# Altium schematic sheet Microcontroller.SchDoc
size A3; SheetNumber: 4; SheetTotal: 5
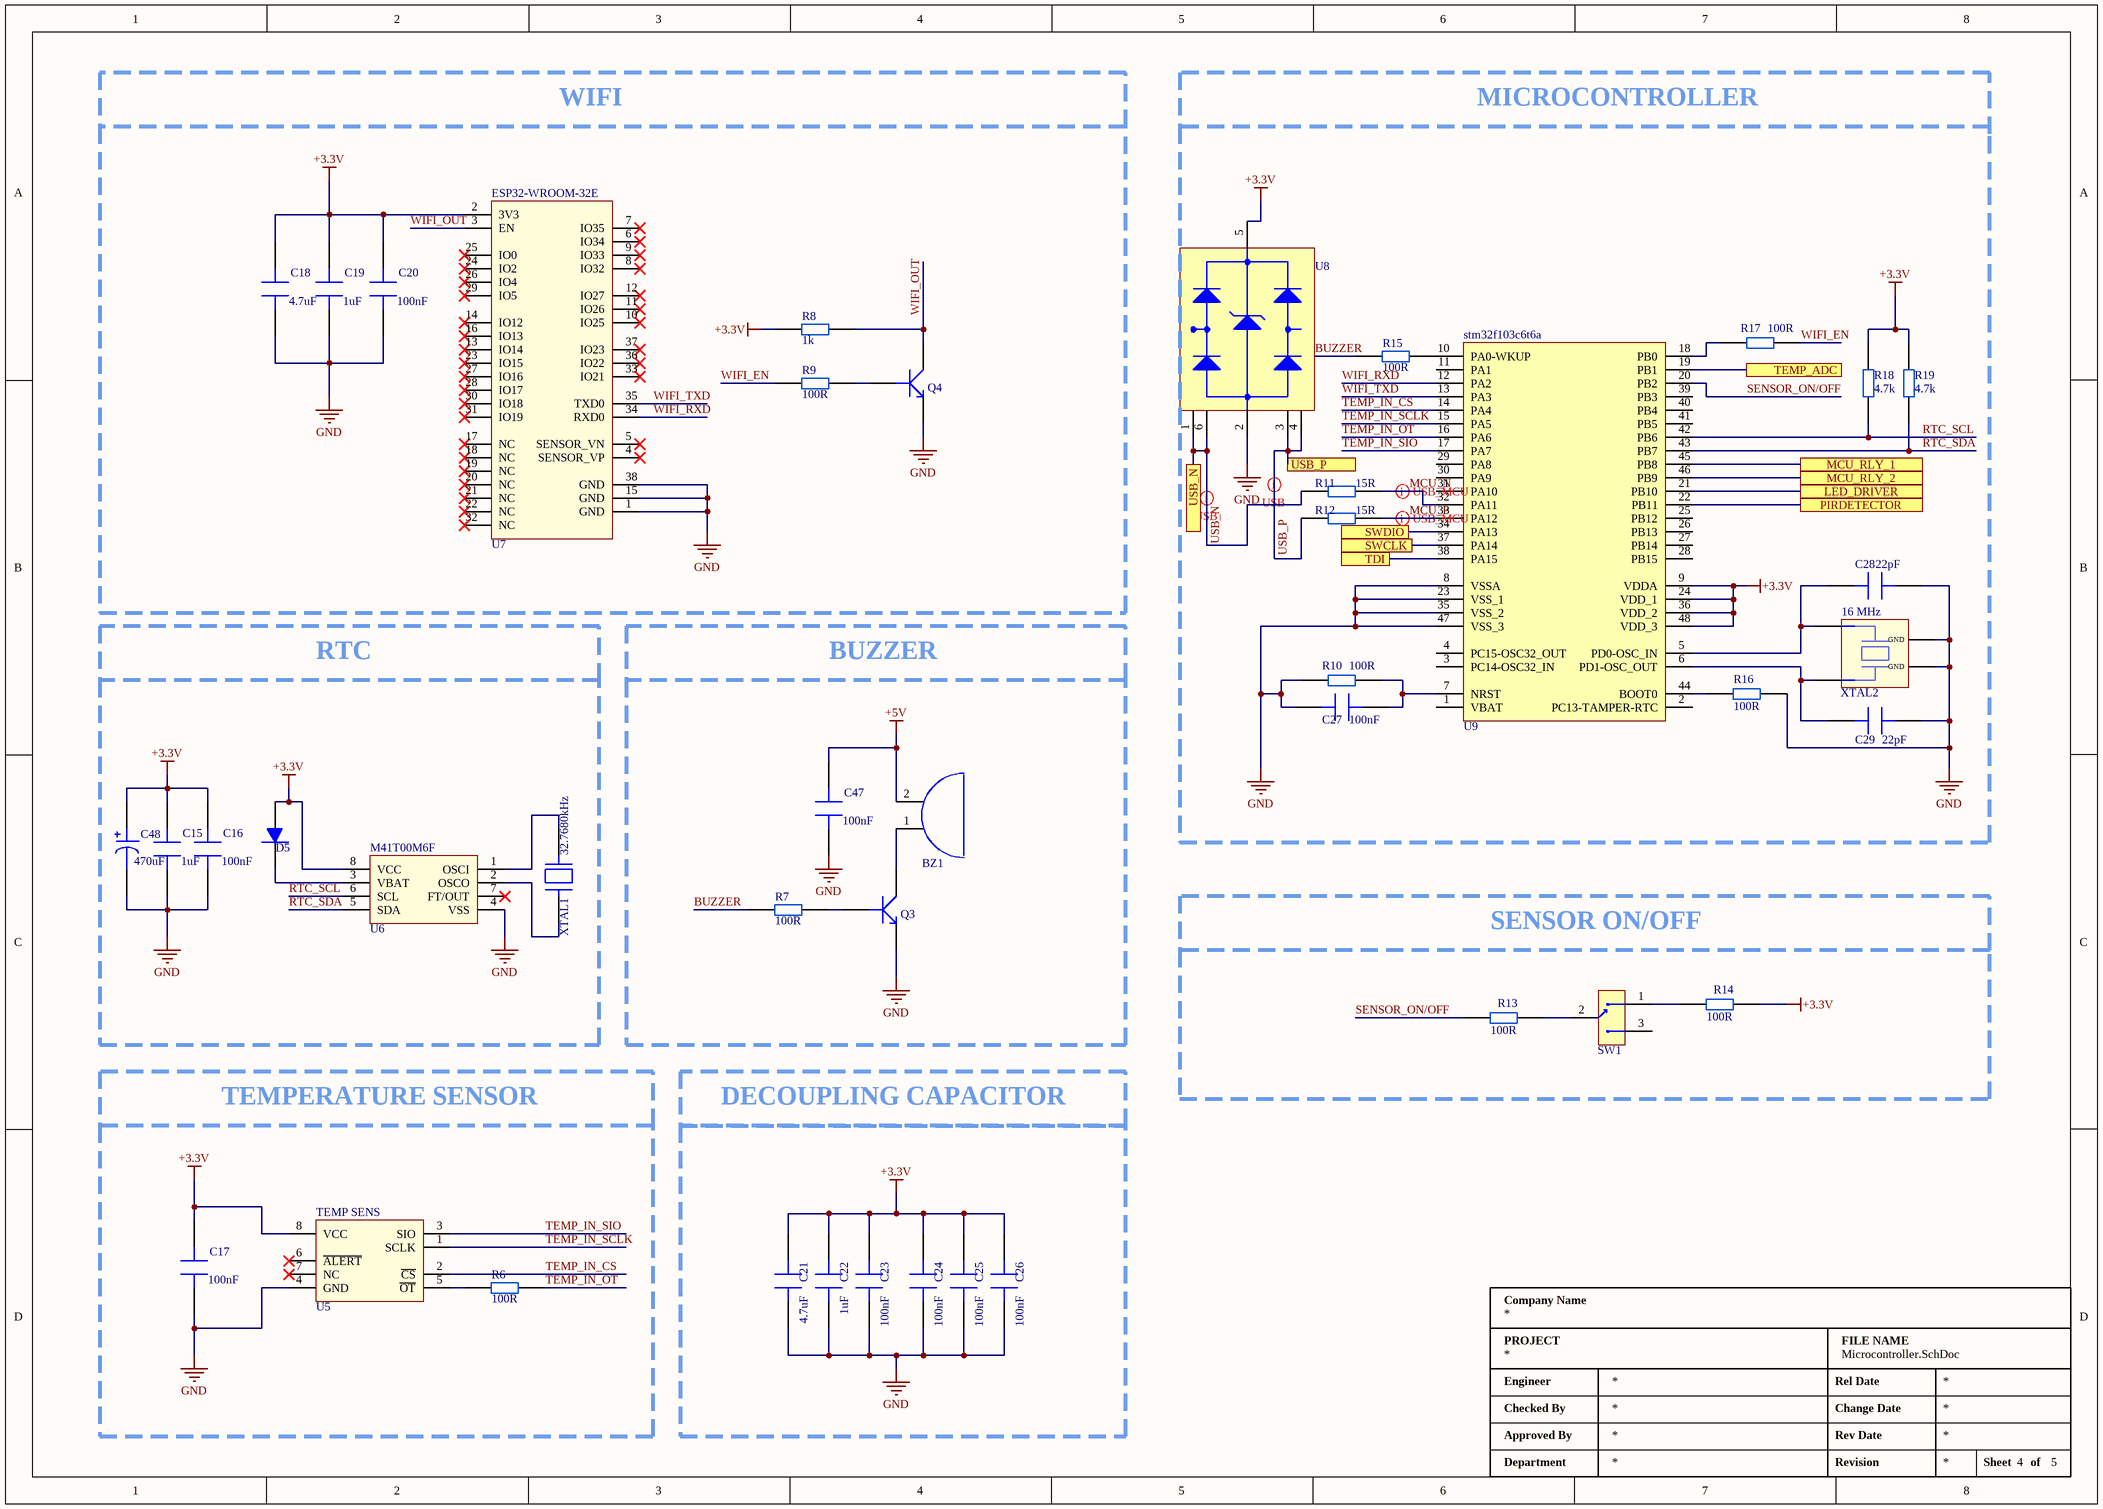
[diagram p0: Microcontroller.SchDoc]

## Parts
BZ1  CMI-9605-0580T  [BUZZER]  (value not drawn)
C15  value 1uF  [CAP 0805]  (hidden comment: Auto Grade Capacitor,0805,X7R,10)
C16  value 100nF  [CAP 0805]  (hidden comment: CAP CER 0.1UF 50V X7R 0805)
C17  value 100nF  [CAP 0603]  (hidden comment: CAP CER 100nF 0603)
C18  value 4.7uF  [CAP 0805]  (hidden comment: CAP CER 4.7UF 25V X5R 0805)
C19  value 1uF  [CAP 0805]  (hidden comment: Auto Grade Capacitor,0805,X7R,10)
C20  value 100nF  [CAP 0805]  (hidden comment: CAP CER 0.1UF 50V X7R 0805)
C21  value 4.7uF  [CAP 0805]  (hidden comment: CAP CER 4.7UF 25V X5R 0805)
C22  value 1uF  [CAP 0805]  (hidden comment: Auto Grade Capacitor,0805,X7R,10)
C23  value 100nF  [CAP 0805]  (hidden comment: CAP CER 0.1UF 50V X7R 0805)
C24  value 100nF  [CAP 0805]  (hidden comment: CAP CER 0.1UF 50V X7R 0805)
C25  value 100nF  [CAP 0805]  (hidden comment: CAP CER 0.1UF 50V X7R 0805)
C26  value 100nF  [CAP 0805]  (hidden comment: CAP CER 0.1UF 50V X7R 0805)
C27  value 100nF  [CAP 0805]  (hidden comment: CAP CER 0.1UF 50V X7R 0805)
C28  value 22pF  [CAP 0603]  (hidden comment: CAP CER 22PF 50V C0G/NP0 0603)
C29  value 22pF  [CAP 0603]  (hidden comment: CAP CER 22PF 50V C0G/NP0 0603)
C47  value 100nF  [CAP 0805]  (hidden comment: CAP CER 0.1UF 50V X7R 0805)
C48  value 470uF  [CAP ALUM 470UF 20% 50V RADIAL TH]  (hidden comment: CAP ALUM 470UF 20% 50V RADIAL TH)
D5  DIODE GEN PURP 75V 150MA SOD323F  [DIODE SOD323F]  (value not drawn)
Q3  TRANS NPN 40V 0.2A SOT23  [SOT-23-3]  (value not drawn)
Q4  TRANS NPN 40V 0.2A SOT23  [SOT-23-3]  (value not drawn)
R6  value 100R  [RES 0603]  (hidden comment: RES 10K 0603)
R7  value 100R  [RES 0603]  (hidden comment: RES 10K 0603)
R8  value 1k  [RES 0603]  (hidden comment: RES 10K 0603)
R9  value 100R  [RES 0603]  (hidden comment: RES 10K 0603)
R10  value 100R  [RES 0603]  (hidden comment: RES 10K 0603)
R11  value 15R  [RES 0603]  (hidden comment: RES 15 OHM 1% 1/10W 0603)
R12  value 15R  [RES 0603]  (hidden comment: RES 15 OHM 1% 1/10W 0603)
R13  value 100R  [RES 0603]  (hidden comment: RC0603JR-070RL)
R14  value 100R  [RES 0603]  (hidden comment: RC0603JR-070RL)
R15  value 100R  [RES 0603]  (hidden comment: RES 10K 0603)
R16  value 100R  [RES 0603]  (hidden comment: RES 10K 0603)
R17  value 100R  [RES 0603]  (hidden comment: RES 10K 0603)
R18  value 4.7k  [RES 0603]  (hidden comment: RES 10K 0603)
R19  value 4.7k  [RES 0603]  (hidden comment: RES 10K 0603)
SW1  EG1215AA  [EG1215AA]  (value not drawn)
U5  TEMP SENS  [SOIC8]
U6  M41T00M6F  [SOIC8]
U7  ESP32-WROOM-32E  [ESP32 WROOM 4MB]
U8  TVS DIODE 5.25VWM 17VC SOT23-6  [SOT23-6]  (value not drawn)
U9  stm32f103c6t6a  [LQFP-48]
XTAL1  32.7680kHz  [CRYSTALL 2SMD]
XTAL2  16 MHz  [CRYSTAL 16MHz 4SMD]

## Blocks framed on the sheet
WIFI: C18-C20 Q4 R8 R9 U7
MICROCONTROLLER: C27-C29 R10-R12 R15-R19 U8 U9 XTAL2
RTC: C15 C16 C48 D5 U6 XTAL1
BUZZER: BZ1 C47 Q3 R7
SENSOR ON/OFF: R13 R14 SW1
TEMPERATURE SENSOR: C17 R6 U5
DECOUPLING CAPACITOR: C21-C26

## Ports
LED_DRIVER (see Power Management[6C], SensorBoard[4D], SensorBoard[6B]), MCU_RLY_1 (see Power Management[4B]), MCU_RLY_2 (see Power Management[6B]), PIRDETECTOR (see Power Management[6C]), SWCLK (see Power Management[4C]), SWDIO (see Power Management[4C]), TDI (see Power Management[4D]), TEMP_ADC (see Power Management[6C], SensorBoard[3D], SensorBoard[6A]), USB_N (see Power Management[6C]), USB_P (see Power Management[6C])

## Nets
+3.3V: C15.2 C16.2 C17.2 C18.2 C19.2 C20.2 C21.2 C22.2 C23.2 C24.2 C25.2 C26.2 C48.1 D5.A R8.2 R14.2 R18.2 R19.2 U5.8(VCC) U6.8(VCC) U7.2(3V3) U8.5(VBUS) U9.9(VDDA) U9.24(VDD_1) U9.36(VDD_2) U9.48(VDD_3)
+5V: BZ1.2 C47.2
GND: C15.1 C16.1 C17.1 C18.1 C19.1 C20.1 C21.1 C22.1 C23.1 C24.1 C25.1 C26.1 C27.1 C28.1 C29.1 C47.1 C48.2 Q3.2(E) Q4.2(E) R10.2 R16.1 U5.4(GND) U6.4(VSS) U7.1(GND) U7.15(GND) U7.38(GND) U8.2(GND) U9.8(VSSA) U9.23(VSS_1) U9.35(VSS_2) U9.47(VSS_3) XTAL2.2(GND) XTAL2.4(GND)
BUZZER: R7.1 R15.1
LED_DRIVER: U9.21(PB10) ; port LED_DRIVER
MCU_N: R11.2 U9.32(PA11)
MCU_P: R12.2 U9.33(PA12)
MCU_RLY_1: U9.45(PB8) ; port MCU_RLY_1
MCU_RLY_2: U9.46(PB9) ; port MCU_RLY_2
PIRDETECTOR: U9.22(PB11) ; port PIRDETECTOR
RTC_SCL: R18.1 U6.6(SCL) U9.42(PB6)
RTC_SDA: R19.1 U6.5(SDA) U9.43(PB7)
SENSOR_ON/OFF: R13.1 U9.20(PB2)
SWCLK: U9.37(PA14) ; port SWCLK
SWDIO: U9.34(PA13) ; port SWDIO
TDI: U9.38(PA15) ; port TDI
TEMP_ADC: U9.19(PB1) ; port TEMP_ADC
TEMP_IN_CS: U5.2(~{CS}) U9.14(PA4)
TEMP_IN_OT: R6.2 U9.16(PA6)
TEMP_IN_SCLK: U5.1(SCLK) U9.15(PA5)
TEMP_IN_SIO: U5.3(SIO) U9.17(PA7)
USB_N: R11.1 U8.1(I/O1_IN) U8.6(I/O1_OUT) ; port USB_N
USB_P: R12.1 U8.3(I/O2_IN) U8.4(I/O2_OUT) ; port USB_P
WIFI_EN: R9.1 R17.1
WIFI_OUT: Q4.3(C) R8.1 U7.3(EN)
WIFI_RXD: U7.34(RXD0) U9.12(PA2)
WIFI_TXD: U7.35(TXD0) U9.13(PA3)
NetBZ1_1: BZ1.1 Q3.3(C)
NetC27_2: C27.2 R10.1 U9.7(NRST)
NetC28_2: C28.2 U9.5(PD0-OSC_IN) XTAL2.1(IN/OUT)
NetC29_2: C29.2 U9.6(PD1-OSC_OUT) XTAL2.3(OUT/IN)
NetD5_C: D5.C U6.3(VBAT)
NetQ3_1: Q3.1(B) R7.2
NetQ4_1: Q4.1(B) R9.2
NetR6_1: R6.1 U5.5(~{OT})
NetR13_2: R13.2 SW1.2
NetR14_1: R14.1 SW1.1
NetR15_2: R15.2 U9.10(PA0-WKUP)
NetR16_2: R16.2 U9.44(BOOT0)
NetR17_2: R17.2 U9.18(PB0)
NetU6_1: U6.1(OSCI) XTAL1.1
NetU6_2: U6.2(OSCO) XTAL1.2

Not connected (* = marked no-connect by the designer): SW1 3(_3); U5 6(~{ALERT})* 7(NC)*; U6 7(FT/OUT)*; U7 4(SENSOR_VP)* 5(SENSOR_VN)* 6(IO34)* 7(IO35)* 8(IO32)* 9(IO33)* 10(IO25)* 11(IO26)* 12(IO27)* 13(IO14)* 14(IO12)* 16(IO13)* 17(NC)* 18(NC)* 19(NC)* 20(NC)* 21(NC)* 22(NC)* 23(IO15)* 24(IO2)* 25(IO0)* 26(IO4)* 27(IO16)* 28(IO17)* 29(IO5)* 30(IO18)* 31(IO19)* 32(NC)* 33(IO21)* 36(IO22)* 37(IO23)*; U9 1(VBAT) 2(PC13-TAMPER-RTC) 3(PC14-OSC32_IN) 4(PC15-OSC32_OUT) 11(PA1) 25(PB12) 26(PB13) 27(PB14) 28(PB15) 29(PA8) 30(PA9) 31(PA10) 39(PB3) 40(PB4) 41(PB5)

## Layout directives
differential pair: MCU_N, MCU_P, USB_N, USB_P

## Notes on the sheet
- Company Name
- Engineer
- PROJECT
- Rel Date
- FILE NAME
- Checked By
- Approved By
- Rev Date
- Change Date
- Department
- Revision
- Sheet
- of

## Library data of the parts
BZ1 = CMI-9605-0580T: 9.6 mm, 5 Vdc, 80 dB, Through Hole, Driving Circuit, Magnetic Audio Indicator Buzzer; Manufacturer: CUI; Designed By: SEFA; Supplier: Digikey; Supplier Part Number: 102-CMI-9605-0580T-ND; Manufacturer Part Number: CMI-9605-0580T; RoHS: No
C15 C19 C22 = CAP MLCC 1uF 0805 MLCC: Multilayer Ceramic Capacitor, 1 uF, 25 V, ï¿½ 10%, X7R, 0805 [2012 Metric]; Manufacturer: KEMET; Manufacturer Part Number: C0805C105K3RACTU; Material: 4241ConductorMaterial; Voltage Rating: 25V; Supplier: Digikey; Supplier Part Number: 399-C0805C105K3RAC7800CT-ND; RoHS: Yes; Category: Ceramic Capacitors; Stock: 115775; Pricing: 1=0,13, 10=0,091, 50=0,054, 100=0,0425, 500=0,03142, 1000=0,02601 (USD); Mounting Technology: Surface Mount; Case/Package: 0805; Pins: 2; Case Code (Imperial): 0805; Case Code (Metric): 2012; Dielectric Material: Ceramic; Min Operating Temperature: -55°C; Max Operating Temperature: 125°C; Tolerance: 10%; Packaging: Tape and Reel; Termination: SMD/SMT; Series: C; Dielectric: X7R; Package Quantity: 2500; Voltage Rating (DC): 25V; Construction: Flat; Voltage: 25V; Length: 2mm; Width: 0.049inch; Height: 1.25mm; Depth: 1.25mm; Thickness: 0.055inch; Radiation Hardening: No; RoHS Compliant: Yes; Reach SVHC Compliant: No
C16 C20 C23-C27 C47 = CAP MLCC 100nF 0805: Multilayer Ceramic Capacitor, 0.1 uF, 50 V, ± 10%, X7R, 0805 [2012 Metric]; Manufacturer: Yageo; Manufacturer Part Number: CC0805KRX7R9BB104; Insulation Resistance: 100GR; Desined By: SEFA; Supplier: Digikey; Supplier Part Number: 311-1140-1-ND; RoHS: Yes; Category: Ceramic Capacitors; Stock: 4906465; Pricing: 1=0,1, 10=0,07, 50=0,0418, 100=0,0329, 500=0,02428, 1000=0,0201, 4000=0,01711, 8000=0,01592, 12000=0,01512, 28000=0,01433, 100000=0,01085, 200000=0,01059, 400000=0,00995 (USD); Mounting Technology: Surface Mount; Case/Package: 0805; Pins: 2; Case Code (Metric): 2012; Case Code (Imperial): 0805; Material: Ceramic; Min Operating Temperature: -55°C; Max Operating Temperature: 125°C; Tolerance: 10%; Dielectric: X7R; Voltage: 50V; Packaging: Tape and Reel; Voltage Rating: 50V; Package Quantity: 4000; Termination: SMD/SMT; Series: CC; Length: 2mm; Height: 0.85mm; Depth: 1.25mm; Radiation Hardening: No; RoHS Compliant: Yes; Reach SVHC Compliant: No; Lead Free: 5697LeadFree; Halogen Free: 5694HalogenFree; ComponentLink1URL: https://datasheet.ciiva.com/11786/0900766b80d84f1d-11786009.pdf?src-supplier=Rs; ComponentLink1Description: https://datasheet.ciiva.com/11786/0900766b80d84f1d-11786009.pdf?src-supplier=Rs; ComponentLink2URL: https://datasheet.ciiva.com/46393/1734573-46393307.pdf?src-supplier=Element14; ComponentLink2Description: https://datasheet.ciiva.com/46393/1734573-46393307.pdf?src-supplier=Element14; ComponentLink3URL: https://datasheet.ciiva.com/155/mlccorderingcode-155930.pdf?src-supplier=Digikey; ComponentLink3Description: https://datasheet.ciiva.com/155/mlccorderingcode-155930.pdf?src-supplier=Digikey; ComponentLink4URL: https://datasheet.ciiva.com/28450/1489800-28450805.pdf?src-supplier=Element14; ComponentLink4Description: https://datasheet.ciiva.com/28450/1489800-28450805.pdf?src-supplier=Element14; ComponentLink5URL: https://datasheet.ciiva.com/155/mlccorderingcode-155929.pdf?src-supplier=Digikey; ComponentLink5Description: https://datasheet.ciiva.com/155/mlccorderingcode-155929.pdf?src-supplier=Digikey; ComponentLink6URL: https://datasheet.ciiva.com/155/mlccorderingcode-155931.pdf?src-supplier=Digikey; ComponentLink6Description: https://datasheet.ciiva.com/155/mlccorderingcode-155931.pdf?src-supplier=Digikey; ComponentLink7URL: https://datasheet.ciiva.com/11464/upy-gphc-x7r-6-3v-to-50v-8-11464757.pdf?src-supplier=Avnet; ComponentLink7Description: https://datasheet.ciiva.com/11464/upy-gphc-x7r-6-3v-to-50v-8-11464757.pdf?src-supplier=Avnet; ComponentLink8URL: https://datasheet.ciiva.com/29242/445210-da-01-en-kerko-chip-0805-x7r-0-1uf-10proz-50vg-29242074.pdf?src-supplier=Conrad; ComponentLink8Description: https://datasheet.ciiva.com/29242/445210-da-01-en-kerko-chip-0805-x7r-0-1uf-10proz-50vg-29242074.pdf?src-supplier=Conrad
C17 = CAP MLCC 100nF 0603: Multilayer Ceramic Capacitor, 0.1 uF, 50 V, ± 10%, X7R, 0603 [1608 Metric]; Manufacturer: Kyocera AVX; Manufacturer Part Number: 06035C104K4T2A; Material: 4241ConductorMaterial; Voltage Rating: 50V; Dissipation Factor: 2.5%; Designed By: SEFA; Supplier: Mouser; Supplier Part Number: 581-06035C104K4; RoHS: Yes; Category: Ceramic Capacitors; Stock: 306954; Pricing: 1=0,1, 10=0,043, 50=0,043, 100=0,021, 1000=0,013, 10000=0,01 (USD); Mounting Technology: Surface Mount; Case/Package: 0603; Pins: 2; Case Code (Metric): 1608; Case Code (Imperial): 0603; Dielectric Material: 4241ConductorMaterial; Min Operating Temperature: -55°C; Max Operating Temperature: 125°C; Package Quantity: 1; Tolerance: 10%; Packaging: Tape and Reel; Voltage Rating (DC): 50V; Dielectric: X7R; Termination: SMD/SMT; Voltage: 50V; Series: -; Construction: Flat; Length: 1.6mm; Width: 0.032inch; Height: 0.9mm; Thickness: 0.035inch; Depth: 0.81mm; Ratings: AEC-Q200; Radiation Hardening: No; Lead Free: 5697LeadFree; Reach SVHC Compliant: No; RoHS Compliant: Yes; ComponentLink1URL: https://datasheet.ciiva.com/26859/getdatasheetpartid-379206-26859871.pdf?src-supplier=Verical; ComponentLink1Description: https://datasheet.ciiva.com/26859/getdatasheetpartid-379206-26859871.pdf?src-supplier=Verical; ComponentLink2URL: https://datasheet.ciiva.com/11786/0900766b80dc2409-11786365.pdf?src-supplier=Rs; ComponentLink2Description: https://datasheet.ciiva.com/11786/0900766b80dc2409-11786365.pdf?src-supplier=Rs; ComponentLink3URL: https://datasheet.ciiva.com/11503/cauto-11503989.pdf?src-supplier=Avnet; ComponentLink3Description: https://datasheet.ciiva.com/11503/cauto-11503989.pdf?src-supplier=Avnet; ComponentLink4URL: https://datasheet.ciiva.com/1457/1679506-1457867.pdf?src-supplier=Element14; ComponentLink4Description: https://datasheet.ciiva.com/1457/1679506-1457867.pdf?src-supplier=Element14; ComponentLink5URL: https://datasheet.ciiva.com/1124/1679506-1124898.pdf?src-supplier=Element14; ComponentLink5Description: https://datasheet.ciiva.com/1124/1679506-1124898.pdf?src-supplier=Element14; ComponentLink6URL: https://datasheet.ciiva.com/28613/1679506-28613279.pdf?src-supplier=Element14; ComponentLink6Description: https://datasheet.ciiva.com/28613/1679506-28613279.pdf?src-supplier=Element14; ComponentLink7URL: https://datasheet.ciiva.com/152/cauto-152703.pdf?src-supplier=Digikey; ComponentLink7Description: https://datasheet.ciiva.com/152/cauto-152703.pdf?src-supplier=Digikey; ComponentLink8URL: https://datasheet.ciiva.com/152/cauto-152702.pdf?src-supplier=Digikey; ComponentLink8Description: https://datasheet.ciiva.com/152/cauto-152702.pdf?src-supplier=Digikey; ComponentLink9URL: https://datasheet.ciiva.com/152/cauto-152704.pdf?src-supplier=Digikey; ComponentLink9Description: https://datasheet.ciiva.com/152/cauto-152704.pdf?src-supplier=Digikey; ComponentLink10URL: https://datasheet.ciiva.com/5427/cauto-360-5427029.pdf?src-supplier=Mouser; ComponentLink10Description: https://datasheet.ciiva.com/5427/cauto-360-5427029.pdf?src-supplier=Mouser
C18 C21 = CAP MLCC 4.7uF 0805 MLCC: Multilayer Ceramic Capacitor, 4.7 uF, 25 V, ± 10%, X5R, 0805 [2012 Metric]; Manufacturer: Samsung; Manufacturer Part Number: CL21A475KAQNNNE; Designed By: SEFA; Supplier: Digikey; Supplier Part Number: 1276-1244-2-ND; RoHS: Yes; Category: Ceramic Capacitors; Stock: 3176000; Pricing: 2000=0,01305, 4000=0,01194, 10000=0,0111, 14000=0,01055, 50000=0,00978 (USD); Mounting Technology: Surface Mount; Case/Package: 0805; Case Code (Metric): 2012; Case Code (Imperial): 0805; Material: Ceramic; Min Operating Temperature: -55°C; Max Operating Temperature: 85°C; Packaging: Tape and Reel; Tolerance: 10%; Voltage Rating: 25V; Dielectric: X5R; Voltage Rating (DC): 25V; Series: CL; Construction: Flat; Length: 2mm; Height: 1.25mm; Depth: 1.25mm; Radiation Hardening: No; Lead Free: Lead Free; RoHS Compliant: Yes; ComponentLink1URL: https://datasheet.ciiva.com/25798/cl21a475kaqnnne-25798882.pdf?src-supplier=Digikey; ComponentLink1Description: https://datasheet.ciiva.com/25798/cl21a475kaqnnne-25798882.pdf?src-supplier=Digikey
C28 C29 = CAP MLCC 22pF 0603: Multilayer Ceramic Capacitor, 22 pF, 50 V, ï¿½ 5%, C0G (NP0), 0603 [1608 Metric]; Manufacturer: KEMET; Manufacturer Part Number: C0603C220J5GACTU; Material: 4241ConductorMaterial; Designed By: SEFA; Supplier: Digikey; Supplier Part Number: 399-C0603C220J5GAC7867DKR-ND; RoHS: Yes; Category: Ceramic Capacitors; Stock: 193050; Pricing: 1=0,14, 10=0,091, 50=0,0546, 100=0,043, 500=0,03172, 1000=0,02627 (USD); Mounting Technology: Surface Mount,PCB; Case/Package: 0603; Case Code (Metric): 1608; Case Code (Imperial): 0603; Weight: 7.1E-05oz; Min Operating Temperature: -55°C; Max Operating Temperature: 125°C; Tolerance: 5%; Dielectric: C0G; Packaging: Tape and Reel; Voltage Rating (DC): 50V; Termination: SMD/SMT; Voltage: 50V; Series: SMD Comm C0G; Voltage Rating: 50V; Construction: Flat; Length: 1.6mm; Width: 0.8mm; Height: 0.8mm; Depth: 0.8mm; Radiation Hardening: No; RoHS Compliant: Yes; Lead Free: 5697LeadFree; ComponentLink1URL: https://datasheet.ciiva.com/7824/f9080b-0402-series-c0g-7824012.pdf?src-supplier=Element14; ComponentLink1Description: https://datasheet.ciiva.com/7824/f9080b-0402-series-c0g-7824012.pdf?src-supplier=Element14; ComponentLink2URL: https://datasheet.ciiva.com/14586/70095383-14586058.pdf?src-supplier=Allied+Electronics; ComponentLink2Description: https://datasheet.ciiva.com/14586/70095383-14586058.pdf?src-supplier=Allied+Electronics; ComponentLink3URL: https://datasheet.ciiva.com/14599/70095383-14599853.pdf?src-supplier=Allied+Electronics; ComponentLink3Description: https://datasheet.ciiva.com/14599/70095383-14599853.pdf?src-supplier=Allied+Electronics; ComponentLink4URL: https://datasheet.ciiva.com/18192/getdatasheetpartid-385505-18192854.pdf?src-supplier=Verical; ComponentLink4Description: https://datasheet.ciiva.com/18192/getdatasheetpartid-385505-18192854.pdf?src-supplier=Verical
C48 = 470uF ECAP CA-1HM471: Aluminum Electrolytic Capacitor, 470 uF, 63 V, ± 20%, 8000 hours @ 85°C, Axial Leaded; Manufacturer: Vishay BCcomponents; Manufacturer Part Number: MAL202118471E3; Voltage Rating (AC): 63V; Desined By: SEFA; Supplier: Digikey; Supplier Part Number: 4079PHBK-ND; RoHS: Yes; Category: Aluminum Electrolytic Capacitors; Stock: 707; Pricing: 1=4,14, 10=3,177, 50=2,87, 260=2,13581, 520=1,93558, 1040=1,80209, 2600=1,73534, 5200=1,70197 (USD); ComponentLink1URL: https://datasheet.ciiva.com/33738/1796733-33738999.pdf?src-supplier=Farnell; ComponentLink1Description: https://datasheet.ciiva.com/33738/1796733-33738999.pdf?src-supplier=Farnell; ComponentLink2URL: https://datasheet.ciiva.com/11778/0900766b8009bd71-11778242.pdf?src-supplier=Rs; ComponentLink2Description: https://datasheet.ciiva.com/11778/0900766b8009bd71-11778242.pdf?src-supplier=Rs; ComponentLink3URL: https://datasheet.ciiva.com/18442/70122962-18442364.pdf?src-supplier=Allied+Electronics; ComponentLink3Description: https://datasheet.ciiva.com/18442/70122962-18442364.pdf?src-supplier=Allied+Electronics; ComponentLink4URL: https://datasheet.ciiva.com/5331/021asm-239741-5331263.pdf?src-supplier=Mouser; ComponentLink4Description: https://datasheet.ciiva.com/5331/021asm-239741-5331263.pdf?src-supplier=Mouser; ComponentLink5URL: https://datasheet.ciiva.com/100/021asm-100166.pdf?src-supplier=Digikey; ComponentLink5Description: https://datasheet.ciiva.com/100/021asm-100166.pdf?src-supplier=Digikey; ComponentLink6URL: https://datasheet.ciiva.com/11697/021asm-11697518.pdf?src-supplier=Avnet; ComponentLink6Description: https://datasheet.ciiva.com/11697/021asm-11697518.pdf?src-supplier=Avnet
D5 = DIODE 1N4148WS: Diode Ultra Fast Recovery Rectifier 75V 0.15A 2-Pin SOD-323F T/R; Manufacturer: ON Semiconductor / Fairchild; Max Reverse Current: 5uA; Reverse Recovery Time: 4ns; Max Forward Surge Current (Ifsm): 2A; Value: 4pF; Element Configuration: Single; Desined By: SEFA; Supplier: Digikey; Supplier Part Number: 1N4148WSFSCT-ND; Manufacturer Part Number: 1N4148WS; RoHS: Yes; Category: Rectifier Diodes; Stock: 198472; Pricing: 1=0,17, 10=0,104, 100=0,0639, 500=0,04644, 1000=0,04076 (USD); Mounting Technology: Surface Mount; Pins: 2; Weight: 0.0276g; Min Operating Temperature: -55°C; Max Operating Temperature: 150°C; Average Rectified Current: 150mA; Max Reverse Voltage (DC): 75V; Series: -; Packaging: Tape and Reel; Forward Current: 150mA; Package Quantity: 1; Recovery Time: 4ns; Max Repetitive Reverse Voltage (Vrrm): 75V; Reverse Voltage: 75V; Length: 1.8mm; Width: 1.35mm; Height: 1mm; Radiation Hardening: No; RoHS Compliant: Yes; Reach SVHC Compliant: No; Lead Free: 5697LeadFree; ComponentLink1URL: https://datasheet.ciiva.com/15208/getdatasheetpartid-127819-15208358.pdf?src-supplier=Verical; ComponentLink1Description: https://datasheet.ciiva.com/15208/getdatasheetpartid-127819-15208358.pdf?src-supplier=Verical; ComponentLink2URL: https://datasheet.ciiva.com/8300/1n914bws-8300360.pdf?src-supplier=Avnet; ComponentLink2Description: https://datasheet.ciiva.com/8300/1n914bws-8300360.pdf?src-supplier=Avnet
Q3 Q4 = MMBT3904 NPN TR: Transistor: NPN; bipolar; 40V; 0.2A; 350mW; -55+150 deg.C; SMD; SOT23; Manufacturer: Diotec; Designed By: SEFA; Supplier: Mouser; Supplier Part Number: 637-MMBT3904; Manufacturer Part Number: MMBT3904; RoHS: Yes; Category: BJTs; Stock: 65126; Pricing: 1=0,1, 10=0,057, 50=0,057, 100=0,047, 1000=0,033, 10000=0,016 (USD); ComponentLink1URL: http://datasheet.octopart.com/MMBT3904-Diotec-datasheet-20771870.pdf?src-supplier=Verical; ComponentLink1Description: http://datasheet.octopart.com/MMBT3904-Diotec-datasheet-20771870.pdf?src-supplier=Verical; ComponentLink2URL: http://datasheet.octopart.com/MMBT3904-Diotec-datasheet-20771870.pdf?src-supplier=Mouser; ComponentLink2Description: http://datasheet.octopart.com/MMBT3904-Diotec-datasheet-20771870.pdf?src-supplier=Mouser; ComponentLink3URL: http://datasheet.octopart.com/MMBT3904-Diotec-datasheet-20771870.pdf?src-supplier=Onlinecomponents.com; ComponentLink3Description: http://datasheet.octopart.com/MMBT3904-Diotec-datasheet-20771870.pdf?src-supplier=Onlinecomponents.com; ComponentLink4URL: http://datasheet.octopart.com/MMBT3904-Diotec-datasheet-20771870.pdf?src-supplier=Distrelec; ComponentLink4Description: http://datasheet.octopart.com/MMBT3904-Diotec-datasheet-20771870.pdf?src-supplier=Distrelec; ComponentLink5URL: http://datasheet.octopart.com/MMBT3904-Diotec-datasheet-20771870.pdf?src-supplier=DComponents; ComponentLink5Description: http://datasheet.octopart.com/MMBT3904-Diotec-datasheet-20771870.pdf?src-supplier=DComponents; ComponentLink6URL: https://datasheet.octopart.com/MMBT3904-Diotec-datasheet-137255044.pdf?src-supplier=TME; ComponentLink6Description: https://datasheet.octopart.com/MMBT3904-Diotec-datasheet-137255044.pdf?src-supplier=TME; ComponentLink7URL: http://datasheet.octopart.com/MMBT3904-Diotec-datasheet-20771870.pdf?src-supplier=Rutronik; ComponentLink7Description: http://datasheet.octopart.com/MMBT3904-Diotec-datasheet-20771870.pdf?src-supplier=Rutronik; ComponentLink8URL: http://datasheet.octopart.com/MMBT3904-Diotec-datasheet-20771870.pdf?src-supplier=Electro+Sonic; ComponentLink8Description: http://datasheet.octopart.com/MMBT3904-Diotec-datasheet-20771870.pdf?src-supplier=Electro+Sonic; ComponentLink9URL: https://datasheet.octopart.com/MMBT3904-Diotec-datasheet-168810005.pdf?src-supplier=SOS+electronic; ComponentLink9Description: https://datasheet.octopart.com/MMBT3904-Diotec-datasheet-168810005.pdf?src-supplier=SOS+electronic
R6-R10 R15-R19 = RES 10K OHM 0603: Res Thick Film 0603 10K Ohm 5% 1/10W ±100ppm/°C Molded SMD SMD Paper T/R; Manufacturer: Stackpole Electronics; Manufacturer Part Number: RMCF0603JT10K0; Designed By: SEFA; Supplier: Digikey; Supplier Part Number: RMCF0603JT10K0CT-ND; RoHS: Yes; Category: Chip SMD Resistors; Stock: 14247729; Pricing: 1=0,1, 10=0,021, 50=0,0116, 100=0,0093, 500=0,00594, 1000=0,005 (USD); ComponentLink1URL: https://datasheet.ciiva.com/15193/getdatasheetpartid-364254-15193501.pdf?src-supplier=Verical; ComponentLink1Description: https://datasheet.ciiva.com/15193/getdatasheetpartid-364254-15193501.pdf?src-supplier=Verical
R11 R12 = RES 15R OHM 0603: Res Thick Film 0603 15 Ohm 1% 0.1W(1/10W) ±100ppm/C Pad SMD Automotive T/R; Manufacturer: Stackpole Electronics; Manufacturer Part Number: RMCF0603FT15R0; Voltage Rating: 75V; Designed By: SEFA; Supplier: Digikey; Supplier Part Number: RMCF0603FT15R0CT-ND; RoHS: Yes; Category: Chip SMD Resistors; Stock: 270843; Pricing: 1=0,1, 10=0,015, 50=0,009, 100=0,0075, 500=0,00498, 1000=0,00425 (USD); ComponentLink1URL: http://components.arrow.com/part/dataview/46943806S7088093N1174?src-supplier=Arrow+Electronics; ComponentLink1Description: http://components.arrow.com/part/dataview/46943806S7088093N1174?src-supplier=Arrow+Electronics; ComponentLink2URL: https://www.seielect.com/catalog/sei-rmcf_rmcp.pdf?src-supplier=Digikey; ComponentLink2Description: https://www.seielect.com/catalog/sei-rmcf_rmcp.pdf?src-supplier=Digikey; ComponentLink3URL: https://www.seielect.com/catalog/SEI-Packaging.pdf?src-supplier=Digikey; ComponentLink3Description: https://www.seielect.com/catalog/SEI-Packaging.pdf?src-supplier=Digikey; ComponentLink4URL: https://www.seielect.com/catalog/SEI-RMCF_RMCP.pdf?src-supplier=Avnet; ComponentLink4Description: https://www.seielect.com/catalog/SEI-RMCF_RMCP.pdf?src-supplier=Avnet
R13 R14 = RES 0R OHM 0603: GENERAL PURPOSE CHIP RESISTOR Metal Glaze/thick Film, 0.1W, 0ohm, Surface Mount, 0603; Manufacturer: Yageo; Tolerance: 1%; Power Rating: 100mW; Voltage Rating (DC): 50V; Temperature Coefficient: 200ppm/°C; Resistance Tolerance: 5%; Designed By: SEFA; Supplier: Digikey; Supplier Part Number: 311-0.0GRCT-ND; Manufacturer Part Number: RC0603JR-070RL; RoHS: Yes; Category: Chip SMD Resistors; Stock: 3503891; Pricing: 1=0,1, 10=0,015, 25=0,0112, 50=0,0086, 100=0,006, 250=0,0048, 500=0,00386, 1000=0,00284 (USD); Case/Package: 0603; Pins: 2; Contact Plating: Tin,Matte; Case Code (Imperial): 0603; Case Code (Metric): 1608; Min Operating Temperature: -55°C; Max Operating Temperature: 155°C; Resistor Type: Thick Film; Packaging: Tape and Reel; Termination: SMD/SMT; Series: RC; Technology: THICK FILM; Package Quantity: 5000; Voltage Rating: 50V; Features: Moisture Resistant; Max Power Dissipation: 100mW; Number of Terminations: 2; Construction: Rectangular; Length: 1.6mm; Width: 0.8mm; Height: 0.45mm; Depth: 0.8mm; RoHS Compliant: Yes; Reach SVHC Compliant: Unknown; Lead Free: 5697LeadFree; Military Standard: Not; ComponentLink1URL: https://datasheet.ciiva.com/11808/pyu-r-int-6-11808700.pdf?src-supplier=Rs; ComponentLink1Description: https://datasheet.ciiva.com/11808/pyu-r-int-6-11808700.pdf?src-supplier=Rs; ComponentLink2URL: https://datasheet.ciiva.com/22747/443971-22747530.pdf?src-supplier=Element14; ComponentLink2Description: https://datasheet.ciiva.com/22747/443971-22747530.pdf?src-supplier=Element14; ComponentLink3URL: https://datasheet.ciiva.com/12555/rc0603-272842-12555254.pdf?src-supplier=Mouser; ComponentLink3Description: https://datasheet.ciiva.com/12555/rc0603-272842-12555254.pdf?src-supplier=Mouser; ComponentLink4URL: https://datasheet.ciiva.com/7746/1738695-7746421.pdf?src-supplier=Element14; ComponentLink4Description: https://datasheet.ciiva.com/7746/1738695-7746421.pdf?src-supplier=Element14; ComponentLink5URL: https://datasheet.ciiva.com/7746/1738695-7746422.pdf?src-supplier=Element14; ComponentLink5Description: https://datasheet.ciiva.com/7746/1738695-7746422.pdf?src-supplier=Element14; ComponentLink6URL: https://datasheet.ciiva.com/8883/pyu-rc0603-51-rohs-l-4-8883045.pdf?src-supplier=Avnet; ComponentLink6Description: https://datasheet.ciiva.com/8883/pyu-rc0603-51-rohs-l-4-8883045.pdf?src-supplier=Avnet; ComponentLink7URL: https://datasheet.ciiva.com/15189/getdatasheetpartid-329462-15189845.pdf?src-supplier=Verical; ComponentLink7Description: https://datasheet.ciiva.com/15189/getdatasheetpartid-329462-15189845.pdf?src-supplier=Verical
SW1 = EG1215AA: Slide Switch, SPDT, 0.025A, 24V, SMD; Manufacturer: E-Switch; Mechanical Life: 10000Cycles; Switch Function: On-On; Actuator Type: Standard; Switch Travel: 1.5mm; Operating Force: 150gf; Actuator Length: 1.4mm; Designed By: SEFA; Supplier: Digikey; Supplier Part Number: EG5720CT-ND; Manufacturer Part Number: EG1215AA; RoHS: Yes; Stock: 19856; Pricing: 1=0,99, 10=0,951, 25=0,8884, 100=0,7715, 250=0,702, 500=0,6508, 1000=0,60327 (USD); Mounting Technology: Surface Mount; Min Operating Temperature: -20°C; Max Operating Temperature: 70°C; Throw Configuration: SPDT; Packaging: Cut Tape; Voltage Rating (DC): 24V; Termination: Gull Wing; Electrical Life: 10000Cycles; Series: EG; RoHS Compliant: Yes; ComponentLink1URL: https://media.digikey.com/pdf/Data%20Sheets/E-Switch%20PDFs/EG1215_Series_Ds.pdf?src-supplier=Digikey; ComponentLink1Description: https://media.digikey.com/pdf/Data%20Sheets/E-Switch%20PDFs/EG1215_Series_Ds.pdf?src-supplier=Digikey; ComponentLink2URL: http://www.farnell.com/datasheets/2645007.pdf?src-supplier=Farnell; ComponentLink2Description: http://www.farnell.com/datasheets/2645007.pdf?src-supplier=Farnell
U5 = MAX6662: Temp Sensor Digital Serial (3-Wire, SPI) 8-Pin SOIC N Tube; Manufacturer: Maxim; Manufacturer Part Number: MAX6662MSA+; Designed By: SEFA; Supplier: Digikey; Supplier Part Number: MAX6662MSA+-ND; RoHS: Yes; Category: Temperature and Humidity Sensors; Stock: 504; Pricing: 1=4,61, 10=3,454, 25=3,0704, 50=2,9168, 100=2,8401, 500=2,37956, 1000=2,22604 (USD); ComponentLink1URL: https://datasheet.ciiva.com/5299/max6662-89142-5299456.pdf?src-supplier=Mouser; ComponentLink1Description: https://datasheet.ciiva.com/5299/max6662-89142-5299456.pdf?src-supplier=Mouser; ComponentLink2URL: https://datasheet.ciiva.com/3277/max6662-3277979.pdf?src-supplier=Avnet; ComponentLink2Description: https://datasheet.ciiva.com/3277/max6662-3277979.pdf?src-supplier=Avnet; ComponentLink3URL: https://datasheet.ciiva.com/2003/max6662-2003390.pdf?src-supplier=Digikey; ComponentLink3Description: https://datasheet.ciiva.com/2003/max6662-2003390.pdf?src-supplier=Digikey
U6 = M41T00M6F: Low-power serial real-time clock (RTC) with built-in battery switchover circuit; Manufacturer: STMicroelectronics; Manufacturer Part Number: M41T01M6F; Interface: I2C,Serial,2-Wire; Max Supply Voltage: 5.5V; Min Supply Voltage: 2V; Date Format: YY-MM-DD-dd; Time Format: HH:MM:SS; Nominal Supply Current: 800nA; Designed By: SEFA; Supplier: Digikey; Supplier Part Number: 497-14237-1-ND; RoHS: Yes; Category: Real Time Clocks; Stock: 2794; Pricing: 1=3,63, 10=3,264, 25=3,086, 100=2,6746, 250=2,53744, 500=2,27682, 1000=1,92021 (USD); Mounting Technology: Surface Mount; Case/Package: SO; Pins: 8; Weight: 0.01787oz; Min Operating Temperature: -40°C; Max Operating Temperature: 85°C; Packaging: Tape and Reel; Package Quantity: 2500; Logic Function: Clock; Series: -; Radiation Hardening: No; RoHS Compliant: Yes; ComponentLink1URL: https://datasheet.ciiva.com/29654/dm00097496-29654793.pdf?src-supplier=Avnet; ComponentLink1Description: https://datasheet.ciiva.com/29654/dm00097496-29654793.pdf?src-supplier=Avnet; ComponentLink2URL: https://datasheet.ciiva.com/29654/dm00097496-29654793.pdf?src-supplier=Digikey; ComponentLink2Description: https://datasheet.ciiva.com/29654/dm00097496-29654793.pdf?src-supplier=Digikey; ComponentLink3URL: https://datasheet.ciiva.com/29654/dm00097496-29654794.pdf?src-supplier=Digikey; ComponentLink3Description: https://datasheet.ciiva.com/29654/dm00097496-29654794.pdf?src-supplier=Digikey; ComponentLink4URL: https://datasheet.ciiva.com/29654/dm00097496-29654795.pdf?src-supplier=Digikey; ComponentLink4Description: https://datasheet.ciiva.com/29654/dm00097496-29654795.pdf?src-supplier=Digikey
U7 = ESP32-WROOM-32E(4MB): SMD module, ESP32-D0WD-V3, ESP32 ECO V3, 4 MB SPI flash, PCB antenna; Manufacturer: Espressif Systems; Manufacturer Part Number: ESP32-WROOM-32E(M113EH3200PH3Q0); Interface: 39,40,1515,1518,1532Interface; Bandwidth: 72MHz; Data Rate: 150Mbps; Clock Frequency: 2.484GHz; Max Supply Voltage: 3.6V; Min Supply Voltage: 3V; Nominal Supply Current: 500mA; Number of ADC Channels: 16NUMBER; Number of GPIO: 26NUMBER; Designed By: SEFA; Supplier: Digikey; Supplier Part Number: 1965-ESP32-WROOM-32E-N4TR-ND; RoHS: No; Category: RF Receivers, Transceivers; Stock: 7550; Pricing: 650=2,5 (USD); Min Operating Temperature: -40°C; Max Operating Temperature: 85°C; Height: 3.25mm; Datasheet: https://www.espressif.com/sites/default/files/documentation/esp32-wroom-32e_esp32-wroom-32ue_datasheet_en.pdf
U8 = DIODE TVS USB PRODECTION: ESD Suppressor Diode Arrays Uni-Dir 15kV@Air Gap/8kV@Contact Disc 6-Pin SOT-23 T/R; Manufacturer: STMicroelectronics; Manufacturer Part Number: USBLC6-2SC6Y; Direction: Unidirectional; Value: 3.5pF; Operating Supply Voltage: 1.1V; Number of Bidirectional Channels: 2; Reverse Standoff Voltage: 5.25V; Min Breakdown Voltage: 6V; Clamping Voltage: 17V; Power Line Protection: Yes; Leakage Current: 150nA; Test Current: 1mA; ESR: 330R; Peak Pulse Current: 5A; Designed By: SEFA; Supplier: Digikey; Supplier Part Number: 497-11882-1-ND; RoHS: Yes; Category: TVS Diodes; Stock: 78570; Pricing: 1=0,48, 10=0,376, 100=0,2255, 500=0,20882, 1000=0,142 (USD); Mounting Technology: Surface Mount; Case/Package: SOT-23; Pins: 6; Min Operating Temperature: -40°C; Max Operating Temperature: 150°C; Packaging: Tape and Reel; Package Quantity: 1; Number of Channels: 2; Breakdown Voltage: 6V; Termination: SMD/SMT; ESD Protection: Yes; Max Reverse Leakage Current: 150nA; Series: Automotive, AEC-Q101, USBY; Number of Unidirectional Channels: 2; Length: 3mm; Width: 1.75mm; Height: 1.45mm; Depth: 1.75mm; Radiation Hardening: No; Reach SVHC Compliant: No; Lead Free: Lead Free; RoHS Compliant: Yes; ComponentLink1URL: https://datasheet.ciiva.com/12326/dm00055262-101391-12326647.pdf?src-supplier=Mouser; ComponentLink1Description: https://datasheet.ciiva.com/12326/dm00055262-101391-12326647.pdf?src-supplier=Mouser; ComponentLink2URL: https://datasheet.ciiva.com/338/dm00055262-338888.pdf?src-supplier=Digikey; ComponentLink2Description: https://datasheet.ciiva.com/338/dm00055262-338888.pdf?src-supplier=Digikey; ComponentLink3URL: https://datasheet.ciiva.com/338/dm00055262-338887.pdf?src-supplier=Digikey; ComponentLink3Description: https://datasheet.ciiva.com/338/dm00055262-338887.pdf?src-supplier=Digikey; ComponentLink4URL: https://datasheet.ciiva.com/338/dm00055262-338889.pdf?src-supplier=Digikey; ComponentLink4Description: https://datasheet.ciiva.com/338/dm00055262-338889.pdf?src-supplier=Digikey; ComponentLink5URL: https://datasheet.ciiva.com/41442/001183856-da-01-en-diode-esd-2lin-usblc6-2sc6y-sot-23-6-stm-41442876.pdf?src-supplier=Conrad; ComponentLink5Description: https://datasheet.ciiva.com/41442/001183856-da-01-en-diode-esd-2lin-usblc6-2sc6y-sot-23-6-stm-41442876.pdf?src-supplier=Conrad
U9 = stm32f103c6t6a: MCU 32-bit STM32F ARM Cortex M3 RISC 32KB Flash 2.5V/3.3V 48-Pin LQFP Tray; Manufacturer: STMicroelectronics; Number of Timers/Counters: 3; Max Supply Voltage: 3.6V; Interface: I2C,SPI,USART; RAM Size: 10KB; Number of I/Os: 37; Min Supply Voltage: 2V; Data Bus Width: 32b; Clock Frequency: 72MHz; Number of ADC Channels: 10; Designed By: SEFA; Supplier: Digikey; Supplier Part Number: 497-11515-ND; Manufacturer Part Number: STM32F103C6T6A; RoHS: Yes; Category: Microcontrollers; Stock: 977; Pricing: 1=6,07, 10=5,453, 25=5,1552, 80=4,46775, 250=4,23868, 500=3,80336, 1000=3,20766, 2500=3,04728 (USD); Case/Package: LQFP; Pins: 48; Weight: 0.006409oz; Min Operating Temperature: -40°C; Max Operating Temperature: 85°C; Packaging: Tray; Series: STM32F103C6; Package Quantity: 1500; Memory Format: FLASH; Memory Size: 32KB; Core Architecture: ARM; Length: 7mm; Width: 7mm; Height: 1.4mm; Lead Free: Lead Free; RoHS Compliant: Yes; ComponentLink1URL: https://datasheet.ciiva.com/15122/getdatasheetpartid-69879-15122075.pdf?src-supplier=Verical; ComponentLink1Description: https://datasheet.ciiva.com/15122/getdatasheetpartid-69879-15122075.pdf?src-supplier=Verical; ComponentLink2URL: https://datasheet.ciiva.com/14100/pustm-arm-microcont-stm32f103-en-14100507.pdf?src-supplier=Distrelec; ComponentLink2Description: https://datasheet.ciiva.com/14100/pustm-arm-microcont-stm32f103-en-14100507.pdf?src-supplier=Distrelec
XTAL1 = RTC CRYS ABS05-32.768KHZ-T: Crystal 0.032768MHz ±20ppm (Tol) 12.5pF Flexural 90000Ohm 2-Pin CSMD T/R; Manufacturer: Abracon; ESR (Equivalent Series Resistance): 90kR; Designed By: SEFA; Supplier: Digikey; Supplier Part Number: 535-11899-1-ND; Manufacturer Part Number: ABS05-32.768KHZ-T; RoHS: Yes; Category: Crystals; Stock: 123310; Pricing: 1=0,71, 10=0,607, 50=0,5472, 100=0,5233, 500=0,47204, 1000=0,45162 (USD); Mounting Technology: Surface Mount; Case/Package: CSMD; Pins: 2; Min Operating Temperature: -40°C; Max Operating Temperature: 85°C; Packaging: Tape and Reel; Frequency Tolerance: 20ppm; Load Capacitance: 12.5pF; Package Quantity: 3000; Frequency: 32.768kHz; Tolerance: 20ppm; Termination: SMD/SMT; ESR: 90kR; Series: ABS05; Operating Frequency: 32.768 kHz; Length: 1.6mm; Width: 1mm; Height: 0.5mm; Depth: 1mm; Radiation Hardening: No; Reach SVHC Compliant: No; Lead Free: Lead Free; RoHS Compliant: Yes; ComponentLink1URL: https://datasheet.ciiva.com/23810/abs05-23810480.pdf?src-supplier=Newark; ComponentLink1Description: https://datasheet.ciiva.com/23810/abs05-23810480.pdf?src-supplier=Newark; ComponentLink2URL: https://datasheet.ciiva.com/6728/abs05-6728949.pdf?src-supplier=Digikey; ComponentLink2Description: https://datasheet.ciiva.com/6728/abs05-6728949.pdf?src-supplier=Digikey; ComponentLink3URL: https://datasheet.ciiva.com/6728/abs05-6728950.pdf?src-supplier=Digikey; ComponentLink3Description: https://datasheet.ciiva.com/6728/abs05-6728950.pdf?src-supplier=Digikey; ComponentLink4URL: https://datasheet.ciiva.com/16411/abs05-16411149.pdf?src-supplier=Future+Electronics; ComponentLink4Description: https://datasheet.ciiva.com/16411/abs05-16411149.pdf?src-supplier=Future+Electronics
XTAL2 = CRYSTAL 16MHz ECS-160-20-30B-TR: Crystal 16MHz ±30ppm (Tol) ±50ppm (Stability) 20pF FUND 50Ohm 4-Pin Mini-SMD T/R; Manufacturer: ECS International; Designed By: SEFA; Supplier: Digikey; Supplier Part Number: XC1120CT-ND; Manufacturer Part Number: ECS-160-20-30B-TR; RoHS: Yes; Category: Crystals; Stock: 18945; Pricing: 1=0,71, 10=0,609, 50=0,5484, 100=0,5245, 500=0,47318 (USD); ComponentLink1URL: https://datasheet.ciiva.com/853/ecx-53b-853408.pdf?src-supplier=Digikey; ComponentLink1Description: https://datasheet.ciiva.com/853/ecx-53b-853408.pdf?src-supplier=Digikey; ComponentLink2URL: https://datasheet.ciiva.com/853/ecx-53b-853407.pdf?src-supplier=Digikey; ComponentLink2Description: https://datasheet.ciiva.com/853/ecx-53b-853407.pdf?src-supplier=Digikey; ComponentLink3URL: https://datasheet.ciiva.com/853/ecx-53b-853406.pdf?src-supplier=Digikey; ComponentLink3Description: https://datasheet.ciiva.com/853/ecx-53b-853406.pdf?src-supplier=Digikey